# Altium schematic sheet accessory.SchDoc
size A
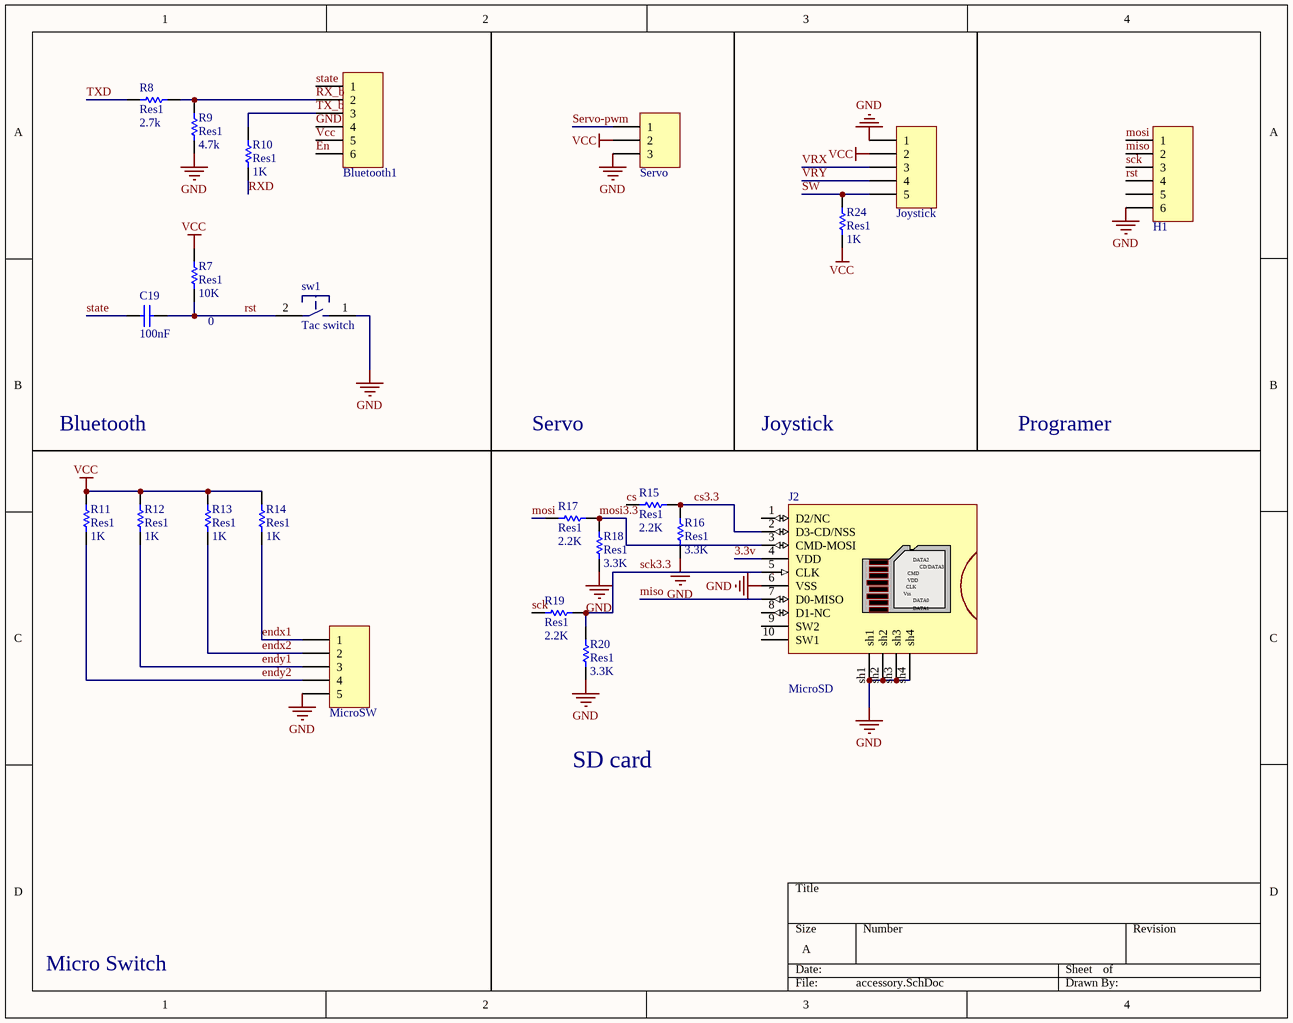
[diagram p0: accessory.SchDoc]

## Parts
Bluetooth1  H-1x6  [H-1x6]  (value not drawn)
C19  value 100nF  [CAP 1206/3216 - 0.8MM]  (hidden comment: Cap)
H1  H-1x6  [H-1x6]  (value not drawn)
J2  MicroSD  [MicroSD_1]
Joystick  H-1x5  [H-1x5]  (value not drawn)
MicroSW  H-1x5  [H-1x5]  (value not drawn)
R7  Res1  value 10K  [RES 1206/3216]
R8  Res1  value 2.7k  [RES 1206/3216]
R9  Res1  value 4.7k  [RES 1206/3216]
R10  Res1  value 1K  [RES 1206/3216]
R11  Res1  value 1K  [RES 1206/3216]
R12  Res1  value 1K  [RES 1206/3216]
R13  Res1  value 1K  [RES 1206/3216]
R14  Res1  value 1K  [RES 1206/3216]
R15  Res1  value 2.2K  [RES 1206/3216]
R16  Res1  value 3.3K  [RES 1206/3216]
R17  Res1  value 2.2K  [RES 1206/3216]
R18  Res1  value 3.3K  [RES 1206/3216]
R19  Res1  value 2.2K  [RES 1206/3216]
R20  Res1  value 3.3K  [RES 1206/3216]
R24  Res1  value 1K  [RES 1206/3216]
Servo  H-1x3  [H-1x3]  (value not drawn)
sw1  Tac switch  [MY_TACTILE-PTH]

## Nets
GND: Bluetooth1.4 H1.6 J2.6(VSS) J2.sh1 J2.sh2 J2.sh3 J2.sh4 Joystick.1 MicroSW.5 R9.1 R16.2 R18.1 R20.1 Servo.3 sw1.1
Vcc: Bluetooth1.5 Joystick.2 R7.2 R11.2 R12.2 R13.2 R14.2 R24.1 Servo.2
3.3v: J2.4(VDD)
cs: R15.2
cs3.3: J2.2(D3-CD/NSS) R15.1 R16.1
En: Bluetooth1.6
endx1: MicroSW.1 R14.1
endx2: MicroSW.2 R13.1
endy1: MicroSW.3 R12.1
endy2: MicroSW.4 R11.1
miso: H1.2 J2.7(D0-MISO)
mosi: H1.1 R17.1
mosi3.3: J2.3(CMD-MOSI) R17.2 R18.2
rst: C19.2 H1.4 R7.1 sw1.2
RX_b: Bluetooth1.2 R8.2 R9.2
RXD: R10.2
sck: H1.3 R19.1
sck3.3: J2.5(CLK) R19.2 R20.2
Servo-pwm: Servo.1
state: Bluetooth1.1 C19.1
SW: Joystick.5 R24.2
TX_b: Bluetooth1.3 R10.1
TXD: R8.1
VRX: Joystick.3
VRY: Joystick.4

Not connected (* = marked no-connect by the designer): H1 5; J2 1(D2/NC) 8(D1-NC) 9(SW2) 10(SW1)

## Notes on the sheet
- (near R7) 0
- Bluetooth
- Servo
- Joystick
- Programer
- SD card
- Micro Switch
- (in symbol MicroSD) DATA2; CD/DATA3; CMD; Vss; DATA0; DATA1

## Library data of the parts
Bluetooth1 H1 = H-1x6: pin to pad: 2>2.5
C19 = Cap ceramic: CAP-100Nf
J2 = MicroSD: MicroSD_altium designer (M.Hariri); Created by:: altium designer (M.Hariri); VALUE: MicroSD
R7-R20 R24 = Res1: Resistor; Published: 8-Jun-2000; LatestRevisionDate: 17-Jul-2002; LatestRevisionNote: Re-released for DXP Platform.; PackageReference: AXIAL-0.3; Publisher: Altium Limited; PackageDescription: Axial Device, Thru-Hole; 2 Leads; 0.3 in Pin Spacing
sw1 = Tac switch: small tac switch